# EAGLE design Adafruit LTC4316 (EAGLE 9.6.2)
COMPANY: ADAFRUIT INDUSTRIES; DRAWN: KTOWN; REV: A
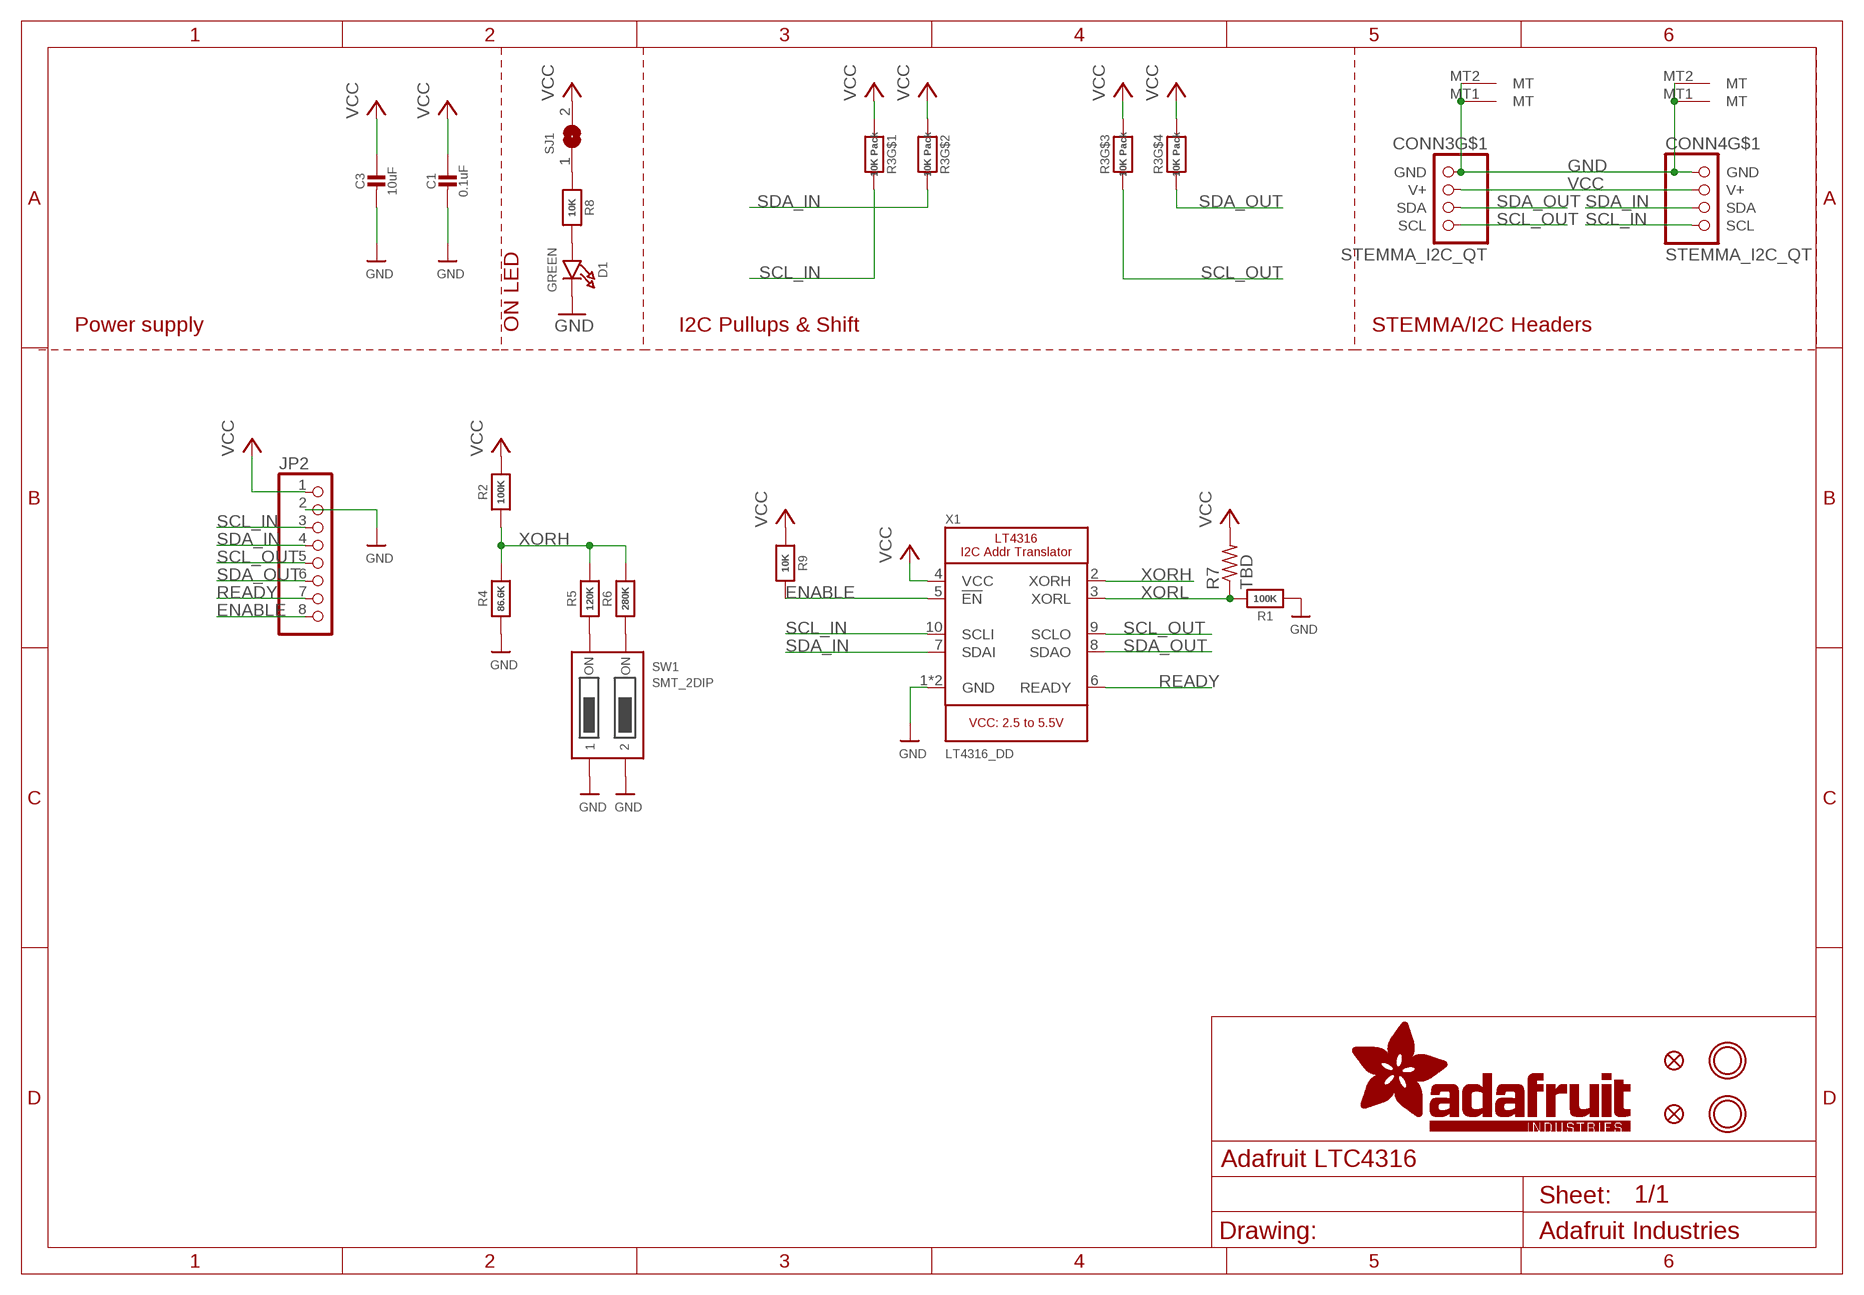
[diagram p0: schematic, sheet 1]

## Parts
C1  0.1uF  CAP_CERAMIC0603_NO  [0603-NO]
C3  10uF  CAP_CERAMIC0805-NOOUTLINE  [0805-NO]
CONN3  STEMMA_I2C_QT  [JST_SH4]
CONN4  STEMMA_I2C_QT  [JST_SH4]
D1  GREEN  LED0603_NOOUTLINE  [CHIPLED_0603_NOOUTLINE]
FID3  FIDUCIAL_1MM  [FIDUCIAL_1MM]
FID4  FIDUCIAL_1MM  [FIDUCIAL_1MM]
JP2  HEADER-1X870MIL  [1X08_ROUND_70]
R1  100K  RESISTOR_0603_NOOUT  [0603-NO]
R2  100K  RESISTOR_0603_NOOUT  [0603-NO]
R3  10K Pack  RESISTOR_4PACK  [RESPACK_4X0603]
R4  86.6K  RESISTOR_0603_NOOUT  [0603-NO]
R5  120K  RESISTOR_0603_NOOUT  [0603-NO]
R6  280K  RESISTOR_0603_NOOUT  [0603-NO]
R7  TBD  R-US_0204/7  [0204/7]
R8  10K  RESISTOR_0603_NOOUT  [0603-NO]
R9  10K  RESISTOR_0603_NOOUT  [0603-NO]
SJ1  SOLDERJUMPERCLOSED  [SOLDERJUMPER_CLOSEDWIRE]
SW1  SMT_2DIP  DIPSWITCH_2PIN  [DIPSWITCH_2PIN]
U$1  MOUNTINGHOLE2.5  [MOUNTINGHOLE_2.5_PLATED]
U$17  MOUNTINGHOLE2.5  [MOUNTINGHOLE_2.5_PLATED]
X1  LT4316_DD  [DFN10_3X3MM]

## Nets
ENABLE: JP2.8 R9.2 X1.5(!EN)
GND [highpower]: C1.2 C3.2 CONN3.1(GND) CONN3.MT1(MT) CONN3.MT2(MT) CONN4.1(GND) CONN4.MT1(MT) CONN4.MT2(MT) D1.C JP2.2 R1.1 R4.1 SW1.1OFF SW1.2OFF X1.1(GND) X1.GND
N$1: D1.A R8.2
N$2: R8.1 SJ1.1
N$3: R5.1 SW1.1ON
N$4: R6.1 SW1.2ON
READY: JP2.7 X1.6(READY)
SCL_IN: CONN4.4(SCL) JP2.3 R3.8 X1.10(SCLI)
SCL_OUT: CONN3.4(SCL) JP2.5 R3.3 X1.9(SCLO)
SDA_IN: CONN4.3(SDA) JP2.4 R3.7 X1.7(SDAI)
SDA_OUT: CONN3.3(SDA) JP2.6 R3.4 X1.8(SDAO)
VCC [highpower]: C1.1 C3.1 CONN3.2(V+) CONN4.2(V+) JP2.1 R2.2 R3.1 R3.2 R3.5 R3.6 R7.2 R9.1 SJ1.2 X1.4(VCC)
XORH: R2.1 R4.2 R5.2 R6.2 X1.2(XORH)
XORL: R1.2 R7.1 X1.3(XORL)

## Notes on the sheet
- Power supply | ON LED | I2C Pullups & Shift | STEMMA/I2C Headers

## Library data of the parts
C1 C3 = microbuilder:CAP_CERAMIC: Ceramic Capacitors For new designs, use the packages preceded by an '_' character since they are more reliable: The following footprints should be used on most boards: _0402 - Standard footprint for regular board layouts _0603 - Standard footprint for regular board layouts _0805 - Standard footprint for regular board layouts _1206 - Standard footprint for regular board layouts For extremely tight-pitch boards where space is at a premium, the following 'micro-pitch' footprints can be used (smaller pads, no silkscreen outline, etc.): _0402MP - Micro-pitch footprint for very dense/compact boards _0603MP - Micro-pitch footprint for very dense/compact boards _0805MP - Micro-pitch footprint for very dense/compact boards _1206MP - Micro-pitch footprint for very dense/compact boards
CONN3 CONN4 = adafruit_electromech:STEMMA_I2C; LCSC: C2845363
D1 = microbuilder:LED: LED 0603 - 0603 Surface Mount Package 2mA: Green LED - Low Power (3.9mcd, 2ma, 1.7Vf) - Digikey: 475-2709-2-ND Orange LED - Low Power (9.8mcd, 2ma, 1.8Vf) - Digikey: 475-1194-2-ND Red LED - Low Power (5mcd, 2ma, 1.8Vf) - Digikey: 475-1195-2-ND Yellow LED - Low Power (7mcd, 2ma, 1.8Vf) - Digikey: 475-1196-2-ND 5mA: Blue LED - Low Power (17mcd, 5ma, 2.9Vf) - Digikey: LNJ937W8CRACT-ND 0805 - 0805 Surface Mount Package 2mA: Red LED (8.8mcd, 2mA, 1.8Vf, Clear) - Low Power [Digikey: 475-2510-1-ND] Green LED (5mcd, 2mA, 1.8Vf, Clear) - Low Power [Digikey: 475-2730-1-ND] Yellow LED (11.3mcd, 2mA, 1.8Vf, Clear) - Low Power [Digikey: 475-2555-1-ND] 20mA: Red LED (104mcd, 20mA, Diffused) - LS R976 [Digikey: 475-1278-6-ND] Red LED (12mcd, 20mA, 2.0Vf, Clear) - APT2012EC [Digikey: 754-1128-1-ND] Green LED (15mcd, 20mA, 2.2Vf, Clear) - APT2012GC [Digikey: 754-1131-1-ND] Orange LED (160mcd, 20mA, 2.1Vf, Clear) - APT2012SECK [Digikey: 754-1130-1-ND] 1206 - 1206 Surface Mount Package Green LED (26mcd, 20mA, Diffused) - LG N971 [Digikey: 475-1407-6-ND] Red LED (15mcd, 20mA, Diffused) - LH N974 [Digikey: 475-1416-6-ND] Cree - Cree High-Power Surface Mount LEDs XPEBWT-L1-0000-00D50 - White 111lm 350mA 2.9Vf 6200K 110° XTEAWT-00-0000-00000LEE3 - White 114lm 350mA 2.85Vf 5000K 115° Everlight - Everlight 45-21 Series Surface Mount LEDs 45-21/QK2C-B2832AC2CB2/2T - Warm White 2000mcd 20mA 3.25Vf 3050K 120° 45-21/LK2C-B38452C4CB2/2T - Nuetral White 2000mcd 20mA 3.25Vf 4150K 120° 45-21/LK2C-B50634C6CB2/2T - Cold White 2200mcd 20mA 3.25Vf 5650K 120° PLCC2 Reverse Mount LS T77K-J1L2-1-0-2-R18-Z - Red 11.25mcd 2mA 1.8Vf 630nm 120° LO T77K-L1M2-24-Z - Orange 19.6mcd 2mA 1.8Vf 606nm 120° LY T77K-K2M1-26-Z - Yellow 15.7mcd 2mA 1.8Vf 587nm 120°; ROT: 270
FID3 FID4 = microbuilder:FIDUCIAL: Fiducial Alignment Points Various fiducial points for machine vision alignment.; BOM: EXCLUDE
JP2 = microbuilder:HEADER-1X8: PIN HEADER
R1 R2 R4-R6 R8 R9 = microbuilder:RESISTOR: Resistors For new designs, use the packages preceded by an '_' character since they are more reliable: The following footprints should be used on most boards: _0402 - Standard footprint for regular board layouts _0603 - Standard footprint for regular board layouts _0805 - Standard footprint for regular board layouts _1206 - Standard footprint for regular board layouts For extremely tight-pitch boards where space is at a premium, the following 'micro-pitch' footprints can be used (smaller pads, no silkscreen outline, etc.): _0402MP - Micro-pitch footprint for very dense/compact boards _0603MP - Micro-pitch footprint for very dense/compact boards _0805MP - Micro-pitch footprint for very dense/compact boards _1206MP - Micro-pitch footprint for very dense/compact boards
R3 = microbuilder:RESISTOR_4PACK: Resistor Packs (4 resistors) 4 x 0603 10K 1/16W - Digikey: YC164J-10KCT-ND
R7 = rcl-ez:R-US_: RESISTOR, American symbol
SJ1 = microbuilder:SOLDERJUMPER: SMD Solder JUMPER Solder the two pads together to create a connection, or remove the solder to break it. REFLOW - Use this footprint for solder paste and reflow ovens. WAVE - Use this footprint for hand-soldering (larger pads). CLOSED - Has a trace between the two pads to ensure it is closed by default. The trace needs to be cut to disable the jumper, and can be closed again by creating a solder bridge between the two pads.
SW1 = adafruit_electromech:DIPSWITCH_2PIN: DIP Switch - 2 Pin - [4UConnector: 19493]
U$1 U$17 = adafruit_electromech:MOUNTINGHOLE: Mounting Hole For #2 screws (0.086"/2.18mm width, 0.094"/2.4mm hole) use 2.5mm; BOM: EXCLUDE
X1 = microbuilder:LT4316

## Net classes
1 highpower: width 0.305 mm, drill 0.483 mm
2 lowpower: width 0.254 mm, drill 0.483 mm

## Board
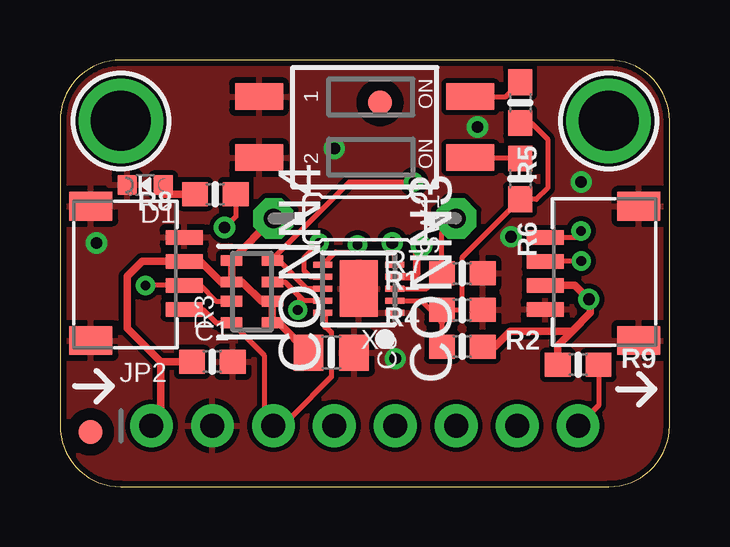
[diagram p1: board, top side]
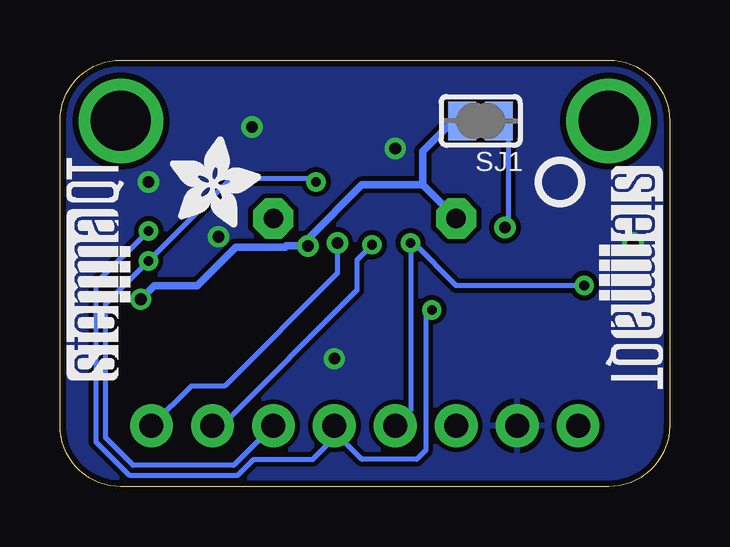
[diagram p2: board, bottom side, seen from below]

Size 25.4 x 17.78 mm. Coordinates in mm from the lower left corner, seen from the top.
Outline: 0,15.24 0,2.54 arc90 2.54,0 22.86,0 arc90 25.4,2.54 25.4,15.24 arc90 22.86,17.78 2.54,17.78 arc90 0,15.24
Copper layers (1*16): Top 0.035mm / dielectric 1.5mm / Bottom 0.035mm
Design rules "adafruit *": minimum track width 8mil, minimum drill 15.5mil, track to track 8mil, track to pad 8mil, pad to pad 8mil, via to via 8mil, smd to smd 8mil, copper to edge 10mil, drill to drill 8mil, minimum pad ring 10mil, minimum via ring 8mil, stop-mask expansion 2mil, vias tented up to drill 20mil, thermal gap 10mil

### Footprints (pad centres in the part's own frame; a part is rotated, then mirrored left to right if it is on the bottom)
0603-NO = smd 1.075 x 1: 1 -0.85,0; 2 0.85,0
0805-NO = smd 1.24 x 1.5: 1 -0.95,0; 2 0.95,0
JST_SH4 = smd 0.6 x 1.55: 1 -1.5,2.006; 2 -0.5,2.006; 3 0.5,2.006; 4 1.5,2.006 | smd 1.2 x 1.8: MT1 -2.8,-1.894; MT2 2.8,-1.894
CHIPLED_0603_NOOUTLINE = smd 0.8 x 0.8: A 0,-0.75; C 0,0.75
FIDUCIAL_1MM = smd 1 x 1: 1 0,0
1X08_ROUND_70 = drill 1 pad 1.778: 1 -8.89,0; 2 -6.35,0; 3 -3.81,0; 4 -1.27,0; 5 1.27,0; 6 3.81,0; 7 6.35,0; 8 8.89,0
RESPACK_4X0603 = smd 0.45 x 0.9: 1 -1.3,-0.85; 2 -0.4,-0.85; 3 0.4,-0.85; 4 1.3,-0.85; 5 1.3,0.85; 6 0.4,0.85; 7 -0.4,0.85; 8 -1.3,0.85
0204/7 = drill 0.813 pad 1.676 octagon: 1 -3.81,0; 2 3.81,0
SOLDERJUMPER_CLOSEDWIRE = smd 1.168 x 1.6: 1 -0.762,0; 2 0.762,0 | smd 0.635 x 0.203: WIRE 0,0
DIPSWITCH_2PIN = smd 1.1 x 2: 1OFF -1.27,-4.4; 1ON -1.27,4.4; 2OFF 1.27,-4.4; 2ON 1.27,4.4
MOUNTINGHOLE_2.5_PLATED = drill 2.5 pad 3.2: P$1 0,0
DFN10_3X3MM = smd 0.25 x 0.8: 1 -1,-1.5; 2 -0.5,-1.5; 3 0,-1.5; 4 0.5,-1.5; 5 1,-1.5; 6 1,1.5; 7 0.5,1.5; 8 0,1.5; 9 -0.5,1.5; 10 -1,1.5 | smd 2.35 x 1.58: GND 0,0

### Placement (x,y rotation side)
C1  6.35,5.21 0 top
C3  11.3,5.59 0 top
CONN3  22.23,8.89 90 top
CONN4  3.17,8.89 270 top
D1  3.56,12.57 90 top
FID3  1.27,2.29 0 top
FID4  13.34,16 0 top
JP2  12.7,2.54 0 top
PLABEL0  [PLABEL0]  3.68,4.19 0 top
PLABEL1  [PLABEL1]  6.35,0.89 0 top
PLABEL2  [PLABEL2]  8.76,4.19 0 top
PLABEL3  [PLABEL3]  11.56,0.89 0 top
PLABEL4  [PLABEL4]  18.92,4.19 0 top
PLABEL5  [PLABEL5]  0.38,12.45 0 top
PLABEL6  [PLABEL6]  13.97,4.19 0 top
PLABEL7  [PLABEL7]  16.64,0.89 0 top
PLABEL8  [PLABEL8]  21.72,0.89 0 top
PLABEL9  [PLABEL9]  6.1,16.13 0 top
PLABEL10  [PLABEL10]  6.1,13.72 0 top
PLABEL11  [PLABEL11]  12.83,11.18 0 top
PLABEL12  [PLABEL12]  15.24,16.13 0 bottom
PLABEL13  [PLABEL13]  12.7,6.6 0 bottom
PLABEL14  [PLABEL14]  12.7,0.89 0 bottom
PLABEL15  [PLABEL15]  7.87,17.02 0 bottom
PLABEL16  [PLABEL16]  12.45,12.19 0 bottom
R1  16.76,8.89 180 top
R2  16.76,5.84 0 top
R3  8,8.13 90 top
R4  16.76,7.37 180 top
R5  19.18,16 270 top
R6  19.18,12.83 270 top
R7  12.7,11.18 180 top
R8  6.48,12.19 180 top
R9  21.59,5.08 0 top
SJ1  7.87,15.24 180 bottom
SW1  12.7,14.99 270 top
U$1  2.54,15.24 0 top
U$17  22.86,15.24 0 top
U$22  [ADAFRUIT_3.5MM]  20.83,10.79 0 bottom
U$25  [PCBFEAT-REV-040]  4.57,12.7 0 bottom
U$30  [STEMMAQT]  22.48,4.45 90 bottom
U$31  [STEMMAQT]  2.92,13.34 270 bottom
X1  12.45,8.26 90 top

### Tracks (layer width: path | path; a pad name or v marks a point on that pad's centre or on a via)
ENABLE  (via drill 0.48)
  Top 0.203: X1.5 13.95,10.06 v13.84,10.16 | R9.2 22.44,3.39 JP2.8
  Bottom 0.203: v13.84,10.16 13.84,8.89 18.54,4.19 19.94,4.19 JP2.8
GND  (via drill 0.48)
  Top 0.305: X1.GND 12.45,7.87
  other vias: 1.52,10.16 11.43,14.1 17.4,14.99 21.72,12.7 13.97,5.33 18.8,10.41
  pour Top: 0,17.78 25.4,17.78 25.4,0 0,0
  pour Bottom: 0,17.78 25.4,17.78 25.4,0 0,0
N$1
  Top 0.305: D1.A 4.31,12.19 R8.2
N$2  (via drill 0.48)
  Top 0.203: R8.1 7.33,11.26 v6.86,10.79
  Bottom 0.203: SJ1.1 6.73,14.86 6.73,10.92 v6.86,10.79
N$3
  Top 0.203: SW1.1ON 18.58,16.26 R5.1
N$4
  Top 0.203: SW1.2ON 19.14,13.72 R6.1
READY  (via drill 0.4)
  Top 0.203: X1.6 11.47,9.78 12.1,9.78 v12.4,10.08
  Bottom 0.203: v12.4,10.08 13.03,9.45 13.03,8.18 18.67,2.54 JP2.7
SCL_IN
  Top 0.203: CONN4.4 5.95,7.39 6.51,6.83 R3.8 8.51,5.47 8.51,3.17 8.89,2.79 | 8.89,2.79 JP2.3 | X1.10 11.05,7.15 11.05,6.64 11.1,6.64 11.3,6.44 11.3,4.57 9.65,2.92 9.02,2.92 8.89,2.79
SCL_OUT  (via drill 0.4)
  Top 0.203: X1.9 10.15,7.75 9.97,7.94 | R3.3 9.38,8.53 9.97,7.94 | 9.97,7.94 9.97,7.43 v9.91,7.37 | CONN3.4 21.49,10.39 21.71,10.61 v21.71,10.66
  Bottom 0.203: v9.91,7.37 10.16,7.11 10.16,1.52 10.54,1.14 12.83,1.14 13.97,2.29 JP2.5 13.97,2.03 14.86,1.14 17.33,1.14 17.99,0.48 22.52,0.48 23.9,1.86 23.9,8.47 v21.71,10.66
SDA_IN  (via drill 0.4)
  Top 0.203: R3.7 6.5,7.73 5.83,8.39 CONN4.3 v3.56,8.39 v3.56,8.38 | v10.79,10.16 10.16,9.53 10.16,9.02 10.42,8.76 X1.7
  Bottom 0.203: JP2.4 10.79,3.17 v10.79,10.16 10.67,10.16 8.89,8.38 v3.56,8.38
SDA_OUT  (via drill 0.4)
  Top 0.203: X1.8 10.29,8.26 9.11,9.43 R3.4 8.85,9.49 12.06,12.7 v14.73,12.7 | v21.72,9.4 21.71,9.39 CONN3.3
  Bottom 0.203: v14.73,12.7 14.86,12.83 18.29,12.83 v21.72,9.4 23.5,7.62 23.5,2.03 22.35,0.89 18.16,0.89 JP2.6
VCC  (via drill 0.48)
  Top 0.305: C3.1 9.11,6.83 R3.1 R3.2 8.4,7.73 7.6,8.53 R3.6 | C1.1 4.19,5.21 | 4.19,5.21 2.79,6.6 2.79,8.76 3.42,9.39 CONN4.2 5.85,9.39 6.71,8.53 R3.6 | 4.19,5.21 4.19,2.92 JP2.1 | R3.6 R3.5 R7.2 | 21.34,6.48 18.76,6.48 18.12,5.84 R2.2 | 21.34,6.48 22.1,7.24 22.1,7.75 v22.04,7.81 21.45,8.39 CONN3.2 | X1.4 14.72,8.76 14.86,8.89 14.86,9.83 v15.06,10.03 | R9.1 20.74,5.88 21.34,6.48
  Bottom 0.305: SJ1.2 9.02,15.24 10.29,13.97 10.29,12.57 | R7.2 10.29,12.57 | v22.04,7.81 21.46,8.38 19.68,8.38 18.09,9.98 16.02,9.98 15.96,10.03 v15.06,10.03 15.06,10.34 12.83,12.57 10.29,12.57
XORH
  Top 0.203: R5.2 19.65,15.15 20.32,14.48 20.32,12.45 19.85,11.98 R6.2 16.76,9.56 16.76,7.37 R4.2 | X1.2 15.06,7.75 15.91,6.91 R2.1
  Top 0.305: R4.2 15.91,6.91
XORL
  Top 0.203: X1.3 15.28,8.26 R1.2 15.91,10.58 R7.1

### Text on the board
Pinguin_tBackup: A5 | A4 | on | XORL | VIN | SCI | SCO | RDY | GND | SDI | SDO | ENA
Pinguin_bBackup: LED | LTC4316 | Optional / XORL | I2C addr. translator / Inverts address bit 6 / Switchable bit 4 & 5 | VLogic/Vcc: 3-5VDC